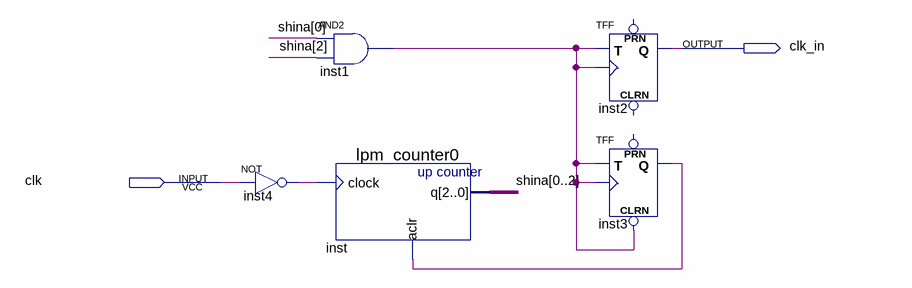
[diagram p0: schematic sheet]
// Quartus schematic Block1.bdf as structural Verilog: 5 symbols, 2 pins
module Block1 (
  input  clk,
  output clk_in
);

  wire inst1_out, inst3_q, inst4_out;
  wire [2:0] shina;

  not inst4 (inst4_out, clk);
  and inst1 (inst1_out, shina[0], shina[2]);
  lpm_counter0 inst (.clock(inst4_out), .aclr(inst3_q), .q({shina[0], shina[1], shina[2]}));
  TFF inst2 (.T(inst1_out), .CLK(inst1_out), .Q(clk_in));  // open: PRN, CLRN
  TFF inst3 (.CLRN(inst1_out), .T(inst1_out), .CLK(inst1_out), .Q(inst3_q));  // open: PRN
endmodule
